# EAGLE design arpie_main (EAGLE 6.6.0)
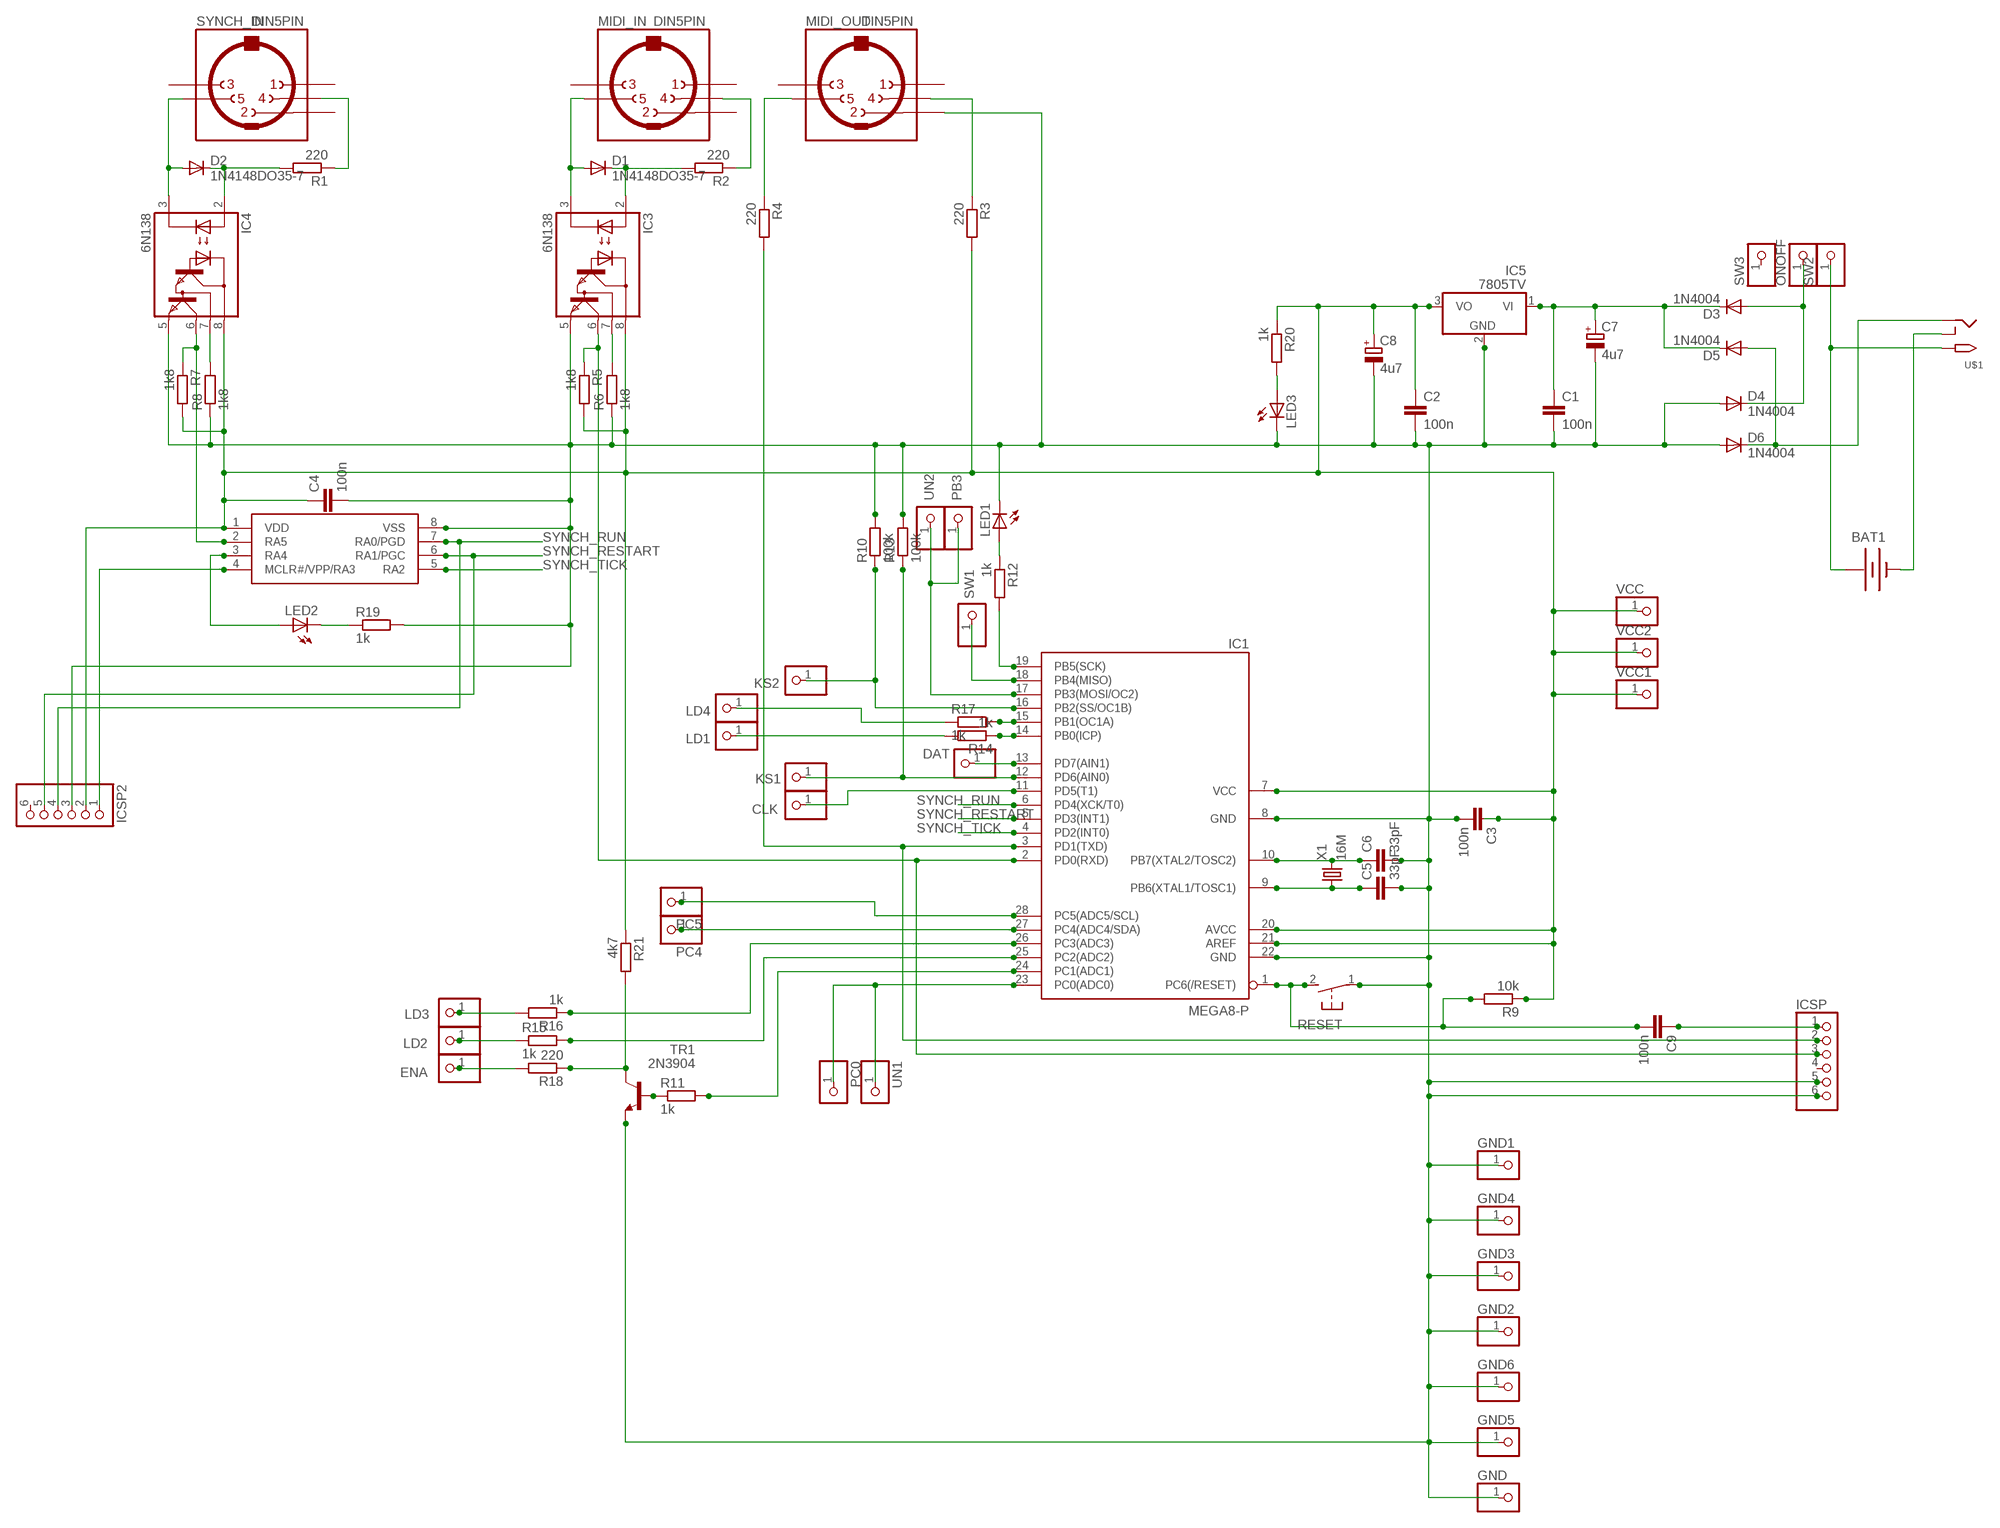
[diagram p0: schematic, sheet 1]

## Parts
BAT1  BATTERY  [PP3_BATTERBOX]
C1  100n  C-EU025-024X044  [C025-024X044]
C2  100n  C-EU025-024X044  [C025-024X044]
C3  100n  C-EU025-024X044  [C025-024X044]
C4  100n  C-EU025-024X044  [C025-024X044]
C5  33pF  C-EU025-024X044  [C025-024X044]
C6  33pF  C-EU025-024X044  [C025-024X044]
C7  4u7  CPOL-EUE2.5-7  [E2,5-7]
C8  4u7  CPOL-EUE2.5-7  [E2,5-7]
C9  100n  C-EU025-024X044  [C025-024X044]
CLK  PINHD-1X1  [1X01]
D1  1N4148DO35-7  [DO35-7]
D2  1N4148DO35-7  [DO35-7]
D3  1N4004  [DO-VERT]
D4  1N4004  [DO-VERT]
D5  1N4004  [DO-VERT]
D6  1N4004  [DO-VERT]
DAT  PINHD-1X1  [1X01]
ENA  PINHD-1X1  [1X01]
GND  PINHD-1X1  [1X01]
GND1  PINHD-1X1  [1X01]
GND2  PINHD-1X1  [1X01]
GND3  PINHD-1X1  [1X01]
GND4  PINHD-1X1  [1X01]
GND5  PINHD-1X1  [1X01]
GND6  PINHD-1X1  [1X01]
IC1  MEGA8-P  [DIL28-3]
IC2  PIC12F1822  [DIL08]
IC3  6N138  [DIL08]
IC4  6N138  [DIL08]
IC5  7805TV  [TO220V]
ICSP  PINHD-1X6  [1X06]
ICSP2  PINHD-1X6  [1X06]
KS1  PINHD-1X1  [1X01]
KS2  PINHD-1X1  [1X01]
LD1  PINHD-1X1  [1X01]
LD2  PINHD-1X1  [1X01]
LD3  PINHD-1X1  [1X01]
LD4  PINHD-1X1  [1X01]
LED1  LED3MM  [LED3MM]
LED2  LED3MM  [LED3MM]
LED3  LED3MM  [LED3MM]
MIDI_IN  DIN5PIN  DIN5PINRAPIDDIN5  [RAPIDDIN5]
MIDI_OUT  DIN5PIN  DIN5PINRAPIDDIN5  [RAPIDDIN5]
ONOFF  PINHD-1X1  [1X01]
PB3  PINHD-1X1  [1X01]
PC0  PINHD-1X1  [1X01]
PC4  PINHD-1X1  [1X01]
PC5  PINHD-1X1  [1X01]
R1  220  R-EU_0207/7  [0207/7]
R2  220  R-EU_0207/7  [0207/7]
R3  220  R-EU_0207/7  [0207/7]
R4  220  R-EU_0207/7  [0207/7]
R5  1k8  R-EU_0207/7  [0207/7]
R6  1k8  R-EU_0207/7  [0207/7]
R7  1k8  R-EU_0207/7  [0207/7]
R8  1k8  R-EU_0207/7  [0207/7]
R9  10k  R-EU_0207/7  [0207/7]
R10  100k  R-EU_0207/7  [0207/7]
R11  1k  R-EU_0207/7  [0207/7]
R12  1k  R-EU_0207/7  [0207/7]
R13  100k  R-EU_0207/2V  [0207/2V]
R14  1k  R-EU_0207/2V  [0207/2V]
R15  1k  R-EU_0207/2V  [0207/2V]
R16  1k  R-EU_0207/2V  [0207/2V]
R17  1k  R-EU_0207/2V  [0207/2V]
R18  220  R-EU_0207/2V  [0207/2V]
R19  1k  R-EU_0207/7  [0207/7]
R20  1k  R-EU_0207/7  [0207/7]
R21  4k7  R-EU_0207/2V  [0207/2V]
RESET  31-XX  [B3F-31XX]
SW1  PINHD-1X1  [1X01]
SW2  PINHD-1X1  [1X01]
SW3  PINHD-1X1  [1X01]
SYNCH_IN  DIN5PIN  DIN5PINRAPIDDIN5  [RAPIDDIN5]
TR1  2N3904  [TO92]
U$1  2.1MMJACKTHM  [PJ-102A]
UN1  PINHD-1X1  [1X01]
UN2  PINHD-1X1  [1X01]
VCC  PINHD-1X1  [1X01]
VCC1  PINHD-1X1  [1X01]
VCC2  PINHD-1X1  [1X01]
X1  16M  CRYSTALHC49S  [HC49/S]

## Nets
CLK: CLK.1 IC1.11(PD5(T1))
DAT: DAT.1 IC1.13(PD7(AIN1))
ENA: ENA.1 R18.2
GND: C1.2 C2.2 C3.2 C4.2 C5.2 C6.2 C7.- C8.- D4.A D6.A GND1.1 GND2.1 GND3.1 GND4.1 GND5.1 GND6.1 GND.1 IC1.8(GND) IC1.22(GND) IC2.8(VSS) IC3.5(GND) IC4.5(GND) IC5.2(GND) ICSP2.3 ICSP.5 ICSP.6 LED1.K(C) LED3.K(C) MIDI_OUT.2 R6.1 R8.1 R10.2 R13.2 R19.2 RESET.1(P) TR1.3(E)
KS1: IC1.12(PD6(AIN0)) KS1.1 R13.1
KS2: IC1.16(PB2(SS/OC1B)) KS2.1 R10.1
LD1: LD1.1 R14.2
LD2: LD2.1 R15.1
LD3: LD3.1 R16.2
LD4: LD4.1 R17.1
N$1: D1.A IC3.3(C) MIDI_IN.5
N$2: D1.C IC3.2(A) R2.2
N$3: MIDI_IN.4 R2.1
N$4: D2.A IC4.3(C) SYNCH_IN.5
N$5: D2.C IC4.2(A) R1.2
N$6: R1.1 SYNCH_IN.4
N$7: IC1.2(PD0(RXD)) IC3.6(VO) ICSP.3 R5.1
N$8: IC3.7(VB) R6.2
N$9: C9.1 ICSP.1
N$10: IC4.7(VB) R8.2
N$11: MIDI_OUT.5 R4.1
N$12: IC1.3(PD1(TXD)) ICSP.2 R4.2
N$13: MIDI_OUT.4 R3.1
N$14: R18.1 R21.2 TR1.1(C)
N$15: IC2.2(RA5) IC4.6(VO) R7.1
N$16: IC2.3(RA4) LED2.A
N$17: IC1.28(PC5(ADC5/SCL)) PC5.1
N$18: IC2.4(MCLR#/VPP/RA3) ICSP2.1
N$19: LED3.A R20.2
N$20: IC1.27(PC4(ADC4/SDA)) PC4.1
N$22: D5.A D6.C U$1.RING
N$33: R11.1 TR1.2(B)
N$35: IC1.26(PC3(ADC3)) R16.1
N$36: C6.1 IC1.10(PB7(XTAL2/TOSC2)) X1.2
N$37: C5.1 IC1.9(PB6(XTAL1/TOSC1)) X1.1
N$38: C9.2 IC1.1(PC6(/RESET)) R9.2 RESET.2(S)
N$42: IC1.25(PC2(ADC2)) R15.2
N$43: IC1.24(PC1(ADC1)) R11.2
N$44: IC1.14(PB0(ICP)) R14.1
N$48: IC1.19(PB5(SCK)) R12.2
N$50: LED1.A R12.1
N$52: LED2.K(C) R19.1
N$54: D3.A D4.C ONOFF.1
N$55: IC1.15(PB1(OC1A)) R17.2
N$56: BAT1.0V(-) U$1.RING_SW
PWR+: BAT1.9V(+) SW2.1 U$1.TIP
SW1: IC1.18(PB4(MISO)) SW1.1
SYNCH_RESTART: IC1.5(PD3(INT1)) IC2.6(RA1/PGC) ICSP2.5
SYNCH_RUN: IC1.6(PD4(XCK/T0)) IC2.7(RA0/PGD) ICSP2.4
SYNCH_TICK: IC1.4(PD2(INT0)) IC2.5(RA2)
UN1: IC1.23(PC0(ADC0)) PC0.1 UN1.1
UN2: IC1.17(PB3(MOSI/OC2)) PB3.1 UN2.1
VCC: C2.1 C3.1 C4.1 C8.+ IC1.7(VCC) IC1.20(AVCC) IC1.21(AREF) IC2.1(VDD) IC3.8(VCC) IC4.8(VCC) IC5.3(VO) ICSP2.2 R3.2 R5.2 R7.2 R9.1 R20.1 R21.1 VCC1.1 VCC2.1 VCC.1
VIN: C1.1 C7.+ D3.C D5.C IC5.1(VI)
Unconnected: ICSP2.6 ICSP.4 MIDI_IN.1 MIDI_IN.2 MIDI_IN.3 MIDI_OUT.1 MIDI_OUT.3 SW3.1 SYNCH_IN.1 SYNCH_IN.2 SYNCH_IN.3

## Library data of the parts
BAT1 = jasons_stuff:BATTERY: Battery Holders Various common sizes : AA, AAA, 20mm coin cell and 12mm coin cell.
C1-C6 C9 = rcl:C-EU: CAPACITOR, European symbol
C7 C8 = rcl:CPOL-EU: POLARIZED CAPACITOR, European symbol
CLK DAT ENA GND GND1-GND6 KS1 KS2 LD1-LD4 ONOFF PB3 PC0 PC4 PC5 SW1-SW3 UN1 UN2 VCC VCC1 VCC2 = adafruit:PINHD-1X1: Pin header 1x1 for 0.1" spacing With round pins
D1 D2 = diode:1N4148: DIODE high speed (Philips)
D3-D6 = jasons_stuff:1N4004: DIODE general purpose rectifier, 1 A
IC1 = atmel:MEGA8-P: MICROCONTROLLER 8 Kbytes FLASH, 1 kbytes SRAM, 512 bytes EEPROM, USART, 4-channel 10 bit ADC, 2-channel 8 bit ADC Pin compatible with Atmega48, ATMega88, ATMega168 Source: avr.lbr
IC2 = jasons_stuff:PIC12F1822
IC3 IC4 = optocoupler:6N138: MOTOROLA OPTO COUPLER
IC5 = linear:78*: Positive VOLTAGE REGULATOR Source: http://cache.national.com/ds/LM/LM78L05.pdf http://www.fairchildsemi.com/ds/LM/LM7805.pdf
ICSP ICSP2 = adafruit:PINHD-1X6: PIN HEADER
LED1-LED3 = adafruit:LED: LED OSRAM: - CHIPLED LG R971, LG N971, LY N971, LG Q971, LY Q971, LO R971, LY R971 LH N974, LH R974 LS Q976, LO Q976, LY Q976 LO Q996 - Hyper CHIPLED LW Q18S LB Q993, LB Q99A, LB R99A - SideLED LS A670, LO A670, LY A670, LG A670, LP A670 LB A673, LV A673, LT A673, LW A673 LH A674 LY A675 LS A676, LA A676, LO A676, LY A676, LW A676 LS A679, LY A679, LG A679 - Hyper Micro SIDELED® LS Y876, LA Y876, LO Y876, LY Y876 LT Y87S - SmartLED LW L88C, LW L88S LB L89C, LB L89S, LG L890 LS L89K, LO L89K, LY L89K LS L896, LA L896, LO L896, LY L896 - TOPLED LS T670, LO T670, LY T670, LG T670, LP T670 LSG T670, LSP T670, LSY T670, LOP T670, LYG T670 LG T671, LOG T671, LSG T671 LB T673, LV T673, LT T673, LW T673 LH T674 LS T676, LA T676, LO T676, LY T676, LB T676, LH T676, LSB T676, LW T676 LB T67C, LV T67C, LT T67C, LS T67K, LO T67K, LY T67K, LW E67C LS E67B, LA E67B, LO E67B, LY E67B, LB E67C, LV E67C, LT E67C LW T67C LS T679, LY T679, LG T679 LS T770, LO T770, LY T770, LG T770, LP T770 LB T773, LV T773, LT T773, LW T773 LH T774 LS E675, LA E675, LY E675, LS T675 LS T776, LA T776, LO T776, LY T776, LB T776 LHGB T686 LT T68C, LB T68C - Hyper Mini TOPLED® LB M676 - Mini TOPLED Santana® LG M470 LS M47K, LO M47K, LY M47K Source: http://www.osram.convergy.de/
MIDI_IN MIDI_OUT SYNCH_IN = jasons_stuff:DIN5PIN: Female CONNECTOR 5 pins 90 deg. with shield, horizontal (DIN 41524)
R1-R21 = rcl:R-EU_: RESISTOR, European symbol
RESET = switch-omron:31-XX: OMRON SWITCH
TR1 = transistor:2N3904: NPN TRANSISTOR
U$1 = adafruit:2.1MMJACK: 2.1mm x 5.5mm THM DC jack with internal switch. Digikey part #PJ-102A, 4UCON part #05537 2.1mm x 5.5mm SMT DC jack with internal switch. Digikey part #PJ-002A-SMT, 4UCON part #03267 By microbuilder.eu & adafruit.com
X1 = crystal:CRYSTAL: CRYSTAL

## Board
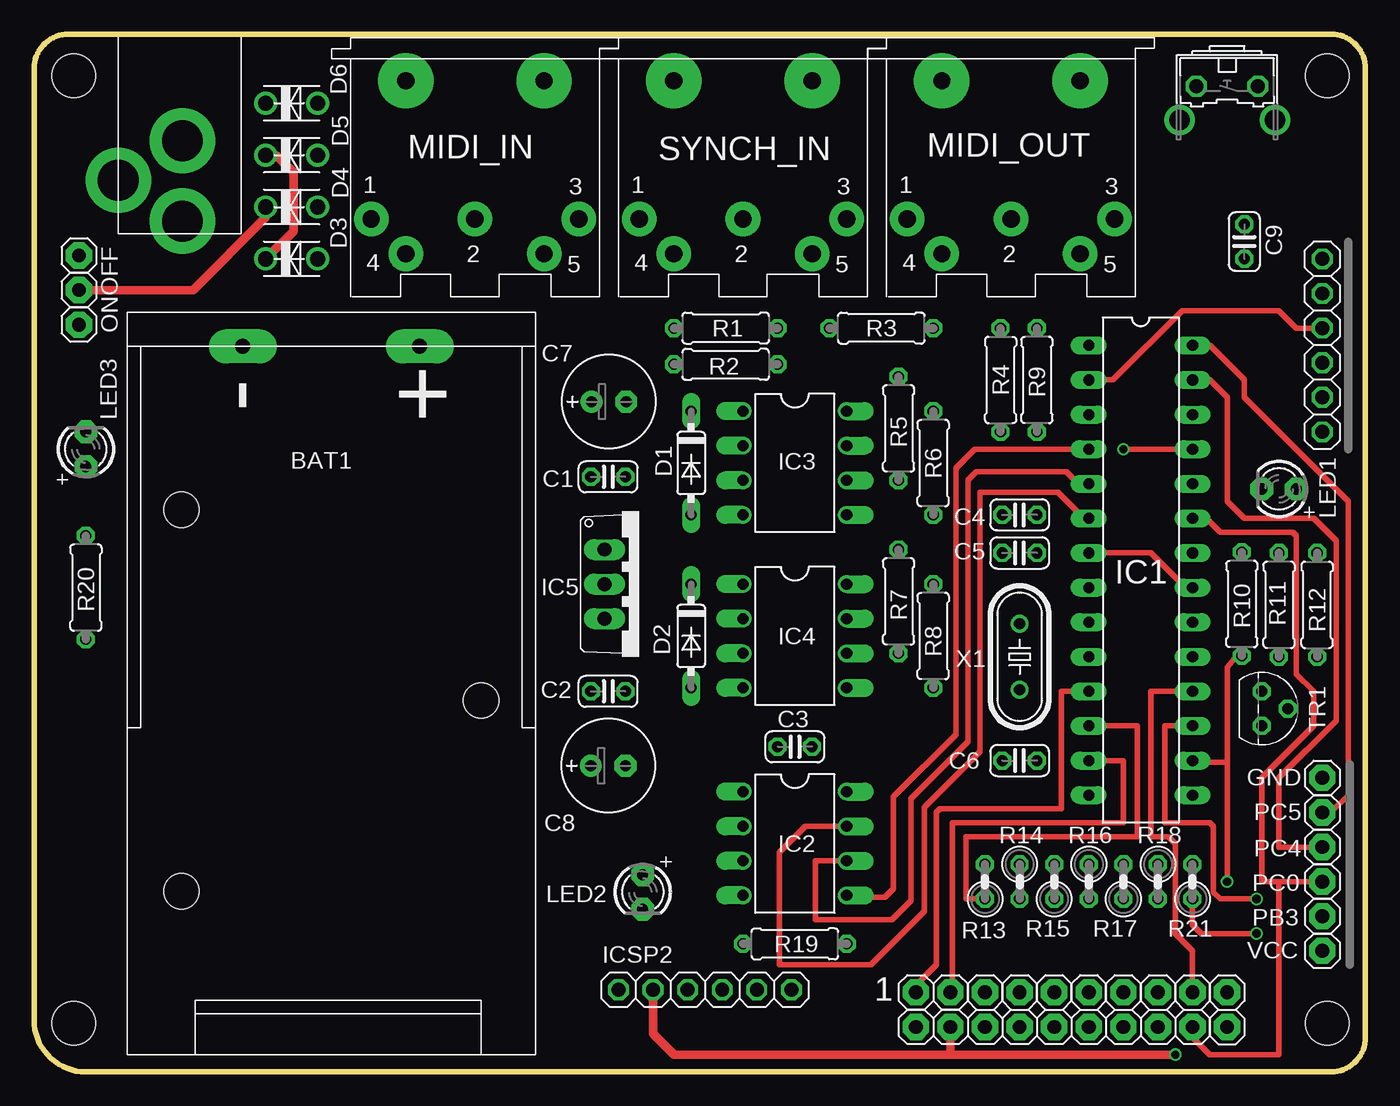
[diagram p1: board, top side]
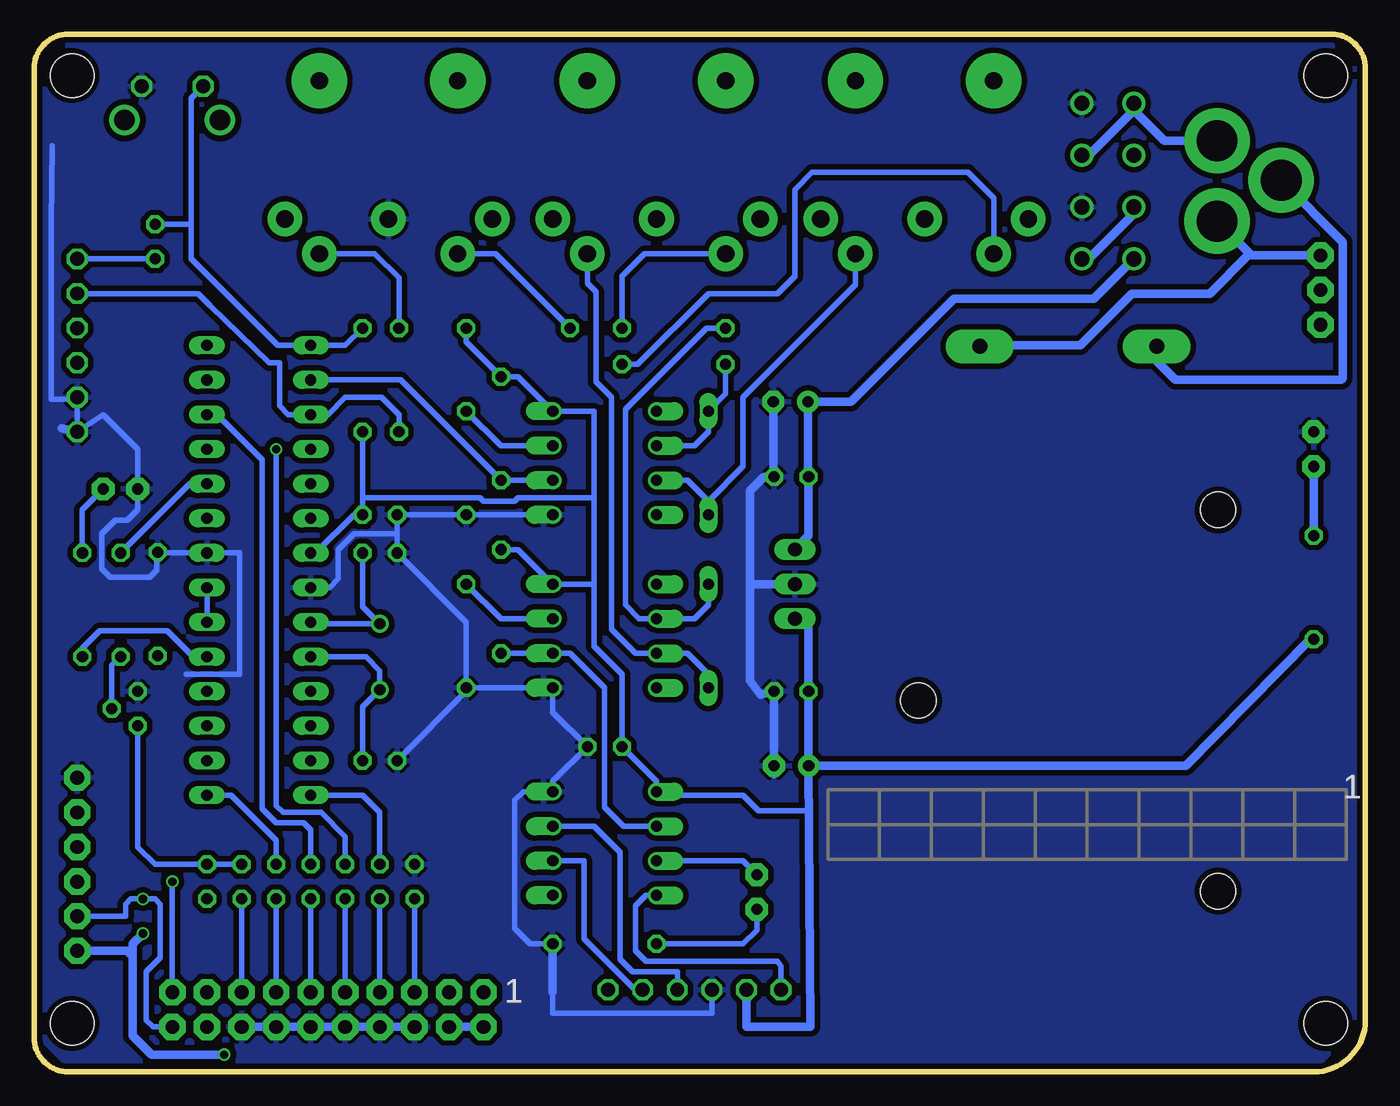
[diagram p2: board, bottom side, seen from below]

Size 97.79 x 76.2 mm. Coordinates in mm from the lower left corner, seen from the top.
Outline: 0,73.66 arc-90 2.54,76.2 95.25,76.2 arc-90 97.79,73.66 97.79,2.54 arc-90 95.25,0 3.81,0 arc-90 0,3.81 0,73.66
Copper layers (1*16): Top 0.035mm / dielectric 1.5mm / Bottom 0.035mm
Design rules "ITEADstudio_DRC": minimum track width 6mil, minimum drill 12mil, track to track 6mil, track to pad 6mil, pad to pad 6mil, via to via 6mil, smd to smd 0mil, copper to edge 10mil, drill to drill 10mil, minimum pad ring 10mil, minimum via ring 6mil, stop-mask expansion 2mil, vias tented up to drill 100mil, thermal gap 10mil
Holes 3.2 mm at 2.92,73.15 2.92,3.56 95,73.15 95,3.56

### Footprints (pad centres in the part's own frame; a part is rotated, then mirrored left to right if it is on the bottom)
PP3_BATTERBOX = drill 1.1 pad 2.5 long: 0V 52,21.5; 9V 52,8.5 | hole 2.6: 12,26; 40,26; 26,4
C025-024X044 = drill 0.813 octagon: 1 -1.27,0; 2 1.27,0
E2,5-7 = drill 0.813 pad 1.6: + -1.27,0 | drill 0.813 pad 1.6 octagon: - 1.27,0
1X01 = drill 1.016 pad 1.93 octagon: 1 0,0
DO35-7 = drill 0.813 long: A 3.81,0; C -3.81,0
DO-VERT = drill 1.118: A 2.54,0; C -1.27,0
DIL28-3 = drill 0.813 long: 1 -16.51,-3.81; 2 -13.97,-3.81; 3 -11.43,-3.81; 4 -8.89,-3.81; 5 -6.35,-3.81; 6 -3.81,-3.81; 7 -1.27,-3.81; 8 1.27,-3.81; 9 3.81,-3.81; 10 6.35,-3.81; 11 8.89,-3.81; 12 11.43,-3.81; 13 13.97,-3.81; 14 16.51,-3.81; 15 16.51,3.81; 16 13.97,3.81; 17 11.43,3.81; 18 8.89,3.81; 19 6.35,3.81; 20 3.81,3.81; 21 1.27,3.81; 22 -1.27,3.81; 23 -3.81,3.81; 24 -6.35,3.81; 25 -8.89,3.81; 26 -11.43,3.81; 27 -13.97,3.81; 28 -16.51,3.81
DIL08 = drill 0.813 offset: 1 -3.81,-3.81; 2 -1.27,-3.81; 3 1.27,-3.81; 4 3.81,-3.81; 5 3.81,3.81; 6 1.27,3.81; 7 -1.27,3.81; 8 -3.81,3.81
TO220V = drill 1.016 long: 1 -2.54,-2.54; 2 0,-2.54; 3 2.54,-2.54
1X06 = drill 1.016 octagon: 1 -6.35,0; 2 -3.81,0; 3 -1.27,0; 4 1.27,0; 5 3.81,0; 6 6.35,0
LED3MM = drill 0.813 pad 1.676 octagon: A -1.27,0; K 1.27,0
RAPIDDIN5 = drill 1.27 pad 2.54: 1 7.62,5.08; 2 0,5.08; 3 -7.62,5.08; 4 5.08,7.62; 5 -5.08,7.62 | drill 1.27 pad 4.064: NC -5.08,-5.08; NC@ 5.08,-5.08
0207/7 = drill 0.813 octagon: 1 -3.81,0; 2 3.81,0
0207/2V = drill 0.813 octagon: 1 -1.27,0; 2 1.27,0
B3F-31XX = drill 1.016 octagon: 1 -2.261,-1.245; 2 2.261,-1.245 | drill 1.499 pad 2.159: 3 -3.505,1.245; 4 3.505,1.245
TO92 = drill 0.813 octagon: 1 1.27,0; 2 0,1.905; 3 -1.27,0
PJ-102A = drill 3 pad 4.8: RING 0.1,-3.39; RING_SW -4.6,-6.29; TIP 0.1,-9.29
HC49/S = drill 0.813: 1 -2.413,0; 2 2.413,0

### Placement (x,y rotation side)
BAT1  36.83,1.27 90 top
C1  42.16,43.69 0 top
C2  42.16,27.94 0 top
C3  55.88,23.88 0 top
C4  72.39,40.89 180 top
C5  72.39,38.1 180 top
C6  72.39,22.86 180 top
C7  42.23,49.21 0 top
C8  42.16,22.48 0 top
C9  88.9,60.96 90 top
CLK  64.77,5.84 0 top
D1  48.26,44.7 270 top
D2  48.26,32 270 top
D3  18.29,59.69 0 top
D4  18.29,63.5 0 top
D5  18.29,67.31 0 top
D6  18.29,71.12 0 top
DAT  67.31,5.84 0 top
ENA  82.55,5.84 90 top
GND  94.61,21.59 0 top
GND1  69.85,3.3 0 top
GND2  72.39,3.3 0 top
GND3  74.93,3.3 0 top
GND4  77.47,3.3 0 top
GND5  80.01,3.3 0 top
GND6  82.55,3.3 0 top
IC1  81.28,36.83 270 top
IC2  55.88,16.76 270 top
IC3  55.88,44.7 270 top
IC4  55.88,32 270 top
IC5  44.45,35.81 270 top
ICSP  94.61,53.34 270 top
ICSP2  49.28,6.03 0 top
KS1  69.85,5.84 90 top
KS2  87.63,5.84 90 top
LD1  72.39,5.84 90 top
LD2  74.93,5.84 90 top
LD3  77.47,5.84 90 top
LD4  80.01,5.84 90 top
LED1  91.44,42.8 180 top
LED2  44.7,13.21 270 top
LED3  3.81,45.72 90 top
MIDI_IN  32.38,67.69 180 top
MIDI_OUT  71.75,67.69 180 top
ONOFF  3.3,57.4 0 top
PB3  94.61,11.43 0 top
PC0  94.61,13.97 0 top
PC4  94.61,16.51 0 top
PC5  94.61,19.05 0 top
R1  50.8,54.61 180 top
R2  50.8,51.94 180 top
R3  62.23,54.61 0 top
R4  70.99,50.8 270 top
R5  63.5,47.24 90 top
R6  66.04,44.7 90 top
R7  63.5,34.54 90 top
R8  66.04,32 90 top
R9  73.66,50.8 90 top
R10  88.71,34.35 90 top
R11  91.44,34.29 90 top
R12  94.23,34.29 270 top
R13  69.85,13.97 90 top
R14  72.39,13.97 270 top
R15  74.93,13.97 90 top
R16  77.47,13.97 270 top
R17  80.01,13.97 90 top
R18  82.55,13.97 270 top
R19  55.88,9.4 0 top
R20  3.81,35.56 90 top
R21  85.09,13.97 90 top
RESET  87.63,71.12 180 top
SW1  85.09,5.84 90 top
SW2  3.3,59.94 0 top
SW3  3.3,54.86 0 top
SYNCH_IN  52.07,67.69 180 top
TR1  90.17,26.67 270 top
U$1  10.79,71.76 0 top
UN1  85.09,3.3 0 top
UN2  87.63,3.3 90 top
VCC  94.61,8.89 0 top
VCC1  64.77,3.3 0 top
VCC2  67.31,3.3 0 top
X1  72.39,30.48 270 top

### Tracks (layer width: path | path; a pad name or v marks a point on that pad's centre or on a via)
CLK
  Top 0.406: IC1.11 75.44,27.94 75.44,19.3 66.55,19.3 66.29,19.05 66.29,7.87 64.77,6.35 CLK.1
DAT
  Top 0.406: DAT.1 67.44,5.97 67.44,18.29 80.01,18.29 80.01,22.86 IC1.13
ENA
  Bottom 0.406: ENA.1 R18.2
GND
  Bottom 0.406: IC3.5 R6.1 C4.2 71.12,39.37 | R8.1 IC4.5 59.69,26.42 C3.2 59.69,21.34 IC2.8 61.85,20.57 62.48,19.94 62.48,10.54 61.34,9.4 R19.2 | 71.12,39.37 C5.2 66.04,33.02 R8.1 | R8.1 66.04,27.94 C6.2 | IC1.8 76.07,35.56 75.44,36.2 75.44,38.35 74.3,39.5 71.25,39.5 71.12,39.37 | 96.47,68 96.52,62.36 96.52,49.4 94.74,49.4 ICSP.5 ICSP.6 92.71,48.26 90.17,45.72 LED1.K 90.17,41.27 90.93,40.51 91.82,40.51 92.84,39.5 92.84,36.96 92.2,36.32 89.28,36.32 88.77,36.83 88.77,38.1 R10.2 88.65,38.1 IC1.22 82.68,38.1 82.68,29.21 86.61,29.21 | 59.69,5.84 59.69,4.32 48.01,4.32 ICSP2.3 | 45.21,28.7 45.21,38.48
  Bottom 0.61: C7.- 43.5,43.75 C1.2 44.2,43.69 45.21,42.67 45.21,38.48 45.21,35.56 | 45.21,35.56 45.21,28.7 44.45,27.69 C2.2 C8.- 43.43,21.84 | IC5.2 44.96,35.81 45.21,35.56 | GND2.1 GND3.1 GND4.1 GND5.1 | ICSP.6 95.76,47.24 | GND1.1 GND2.1 | GND2.1 GND6.1 | 59.69,5.84 R19.2
  pour Bottom (isolate 0.406): 0.51,3.56 0.51,73.15 0.51,73.41 2.79,75.69 95,75.69 97.41,73.28 97.41,3.56 97.41,2.67 95.12,0.38 3.68,0.38
KS1
  Top 0.406: IC1.12 81.03,25.4 81.03,17.27 68.45,17.27 68.45,12.7 R13.1
  Bottom 0.406: KS1.1 R13.1
KS2  (via drill 0.6)
  Top 0.406: R10.1 88.33,30.54 87.63,29.72 87.63,22.73 | 87.63,22.73 85.22,22.73 IC1.16 | 87.63,13.86 v87.63,13.97 87.63,22.73
  Bottom 0.406: KS2.1 v87.63,13.97
LD1
  Bottom 0.406: LD1.1 R14.2
LD2
  Bottom 0.406: LD2.1 R15.1
LD3
  Bottom 0.406: LD3.1 R16.2
LD4
  Bottom 0.406: LD4.1 R17.1
N$1
  Bottom 0.406: IC3.3 49.78,43.43 48.26,41.91 | D1.A 48.26,41.91 | MIDI_IN.5 37.47,57.78 45.72,49.53 45.72,44.45 48.26,41.91
N$2
  Bottom 0.406: IC3.2 49.28,45.97 48.26,46.99 D1.C 46.99,49.78 R2.2
N$3
  Bottom 0.406: MIDI_IN.4 27.3,64.14 29.21,66.04 40.64,66.04 41.91,64.77 41.91,58.42 43.18,57.15 48.26,57.15 53.47,51.94 R2.1
N$4
  Bottom 0.406: D2.A 48.26,29.21 49.78,30.73 IC4.3 53.59,30.73 55.37,32.51 55.37,49.53 56.52,50.67 56.52,57.28 57.15,57.91 SYNCH_IN.5
N$5
  Bottom 0.406: R1.2 48.39,54.61 54.36,48.64 54.36,34.29 53.34,33.27 IC4.2 49.28,33.27 48.26,34.29 D2.C 48.26,36.83
N$6
  Bottom 0.406: R1.1 54.61,58.42 52.96,60.07 SYNCH_IN.4
N$7
  Top 0.406: IC1.2 79.25,50.8 84.33,55.88 91.44,55.88 92.71,54.61 ICSP.3
  Bottom 0.406: IC3.6 R5.1 70.87,50.8 IC1.2
N$8
  Bottom 0.406: IC3.7 63.5,45.97 R6.2
N$9
  Bottom 0.406: C9.1 ICSP.1
N$10
  Bottom 0.406: IC4.7 63.5,33.27 R8.2
N$11
  Bottom 0.406: MIDI_OUT.5 72.77,60.07 70.99,58.29 R4.1
N$12
  Bottom 0.406: ICSP.2 85.72,57.15 84.84,56.26 80.52,52.07 79.76,52.07 79.76,48.89 79.12,48.26 IC1.3 76.2,48.26 74.93,49.53 72.26,49.53 70.99,48.26 R4.2
N$13
  Bottom 0.406: MIDI_OUT.4 63.88,60.07 R3.1
N$14
  Bottom 0.406: TR1.1 90.17,16.51 88.9,15.24 R21.2 R18.1
N$15
  Bottom 0.406: R7.1 IC4.6 58.42,30.73 55.88,28.19 55.88,19.43 54.48,18.03 IC2.2
N$16
  Bottom 0.406: IC2.3 45.72,15.49 LED2.A
N$17
  Top 0.406: IC1.28 86.36,53.34 88.9,50.8 88.9,49.53 96.52,41.91 96.52,20.32 95.25,19.05 PC5.1
N$18
  Bottom 0.406: IC2.4 52.83,12.95 53.59,12.19 53.59,8.89 52.83,8.13 43.18,8.13 42.93,7.75 ICSP2.1 42.93,6.35
N$19
  Bottom 0.61: R20.2 LED3.A
N$20
  Top 0.406: IC1.27 86.36,50.8 87.63,49.53 87.63,41.91 88.9,40.64 93.98,40.64 95.63,38.99 95.63,25.78 91.44,21.59 91.44,16.51 PC4.1 93.98,16.51
N$22
  Bottom 0.61: 17.02,70.61 D6.C | 17.02,70.61 20.32,67.31 D5.A | U$1.RING 14.77,68.37 17.02,70.61
N$33
  Bottom 0.406: TR1.2 92.08,29.84 R11.1
N$35
  Bottom 0.406: IC1.26 84.33,48.26 81.03,44.96 81.03,19.3 80.01,18.29 77.98,18.29 77.47,17.78 R16.1
N$36
  Bottom 0.406: C6.1 73.66,26.8 X1.2 72.39,29.46 73.41,30.48 IC1.10
N$37
  Bottom 0.406: C5.1 73.66,34.16 X1.1 77.34,32.89 IC1.9
N$38
  Bottom 0.406: R9.2 74.93,53.34 IC1.1 79.88,53.34 86.26,59.71 86.26,62.23 | 86.26,62.23 86.26,71.48 RESET.2 | 86.26,62.23 C9.2
N$42  (via drill 0.6)
  Top 0.406: v80.01,45.72 IC1.25
  Bottom 0.406: R15.2 74.93,17.27 76.71,19.05 79.5,19.05 80.01,19.56 v80.01,45.72
N$43
  Bottom 0.406: IC1.24 86.36,43.18 R11.2
N$44
  Bottom 0.406: IC1.14 73.66,20.32 72.39,19.05 R14.1
N$48
  Bottom 0.406: IC1.19 86.11,30.48 88.01,32.38 92.96,32.38 94.23,31.11 R12.2
N$50
  Bottom 0.406: R12.1 94.23,41.27 LED1.A
N$52
  Bottom 0.406: R19.1 45.72,9.4 44.7,10.41 LED2.K
N$54
  Top 0.61: D4.C 17.02,62.74 11.68,57.4 ONOFF.1
  Bottom 0.61: D4.C 17.02,62.99 20.32,59.69 D3.A
N$55
  Bottom 0.406: R17.2 80.01,17.02 83.31,20.32 IC1.15
N$56
  Bottom 0.61: BAT1.0V 15.33,52.16 13.97,50.8 1.78,50.8 1.65,50.93 1.65,60.92 U$1.RING_SW
PWR+
  Bottom 0.61: BAT1.9V 28.26,53.34 20.95,53.34 17.14,57.15 11.43,57.15 8.64,59.94 8.37,59.94 | SW2.1 8.37,59.94 | 8.37,59.94 U$1.TIP
SW1
  Top 0.406: IC1.18 82.04,27.94 82.04,17.27 83.31,17.27 83.82,16.76 83.82,10.16 85.09,8.89 SW1.1
SYNCH_RESTART
  Top 0.406: IC2.6 57.4,15.49 57.4,11.18 62.99,11.18 64.39,12.57 64.39,20.07 68.58,24.26 68.58,43.43 69.21,44.07 75.82,44.07 76.71,43.18 IC1.5
  Bottom 0.406: ICSP2.5 53.66,6.03 57.4,9.78 57.4,15.49 IC2.6
SYNCH_RUN
  Top 0.406: IC1.6 77.09,40.64 75.18,42.55 69.47,42.55 69.47,23.49 65.41,19.43 65.41,11.81 61.47,7.87 54.74,7.87 54.74,16.13 56.64,18.03 IC2.7
  Bottom 0.406: IC2.7 56.64,18.03 54.74,16.13 54.74,8.25 53.85,7.37 50.55,7.37 ICSP2.4
SYNCH_TICK
  Top 0.406: IC2.5 59.82,12.83 62.48,12.83 63.12,13.46 63.12,20.19 67.69,24.77 67.69,44.32 69.09,45.72 IC1.4
UN1
  Top 0.406: UN1.1 85.09,2.54 86.36,1.27 91.44,1.27 91.44,13.97 | IC1.23 86.11,40.64 87.12,39.62 92.46,39.62 92.71,39.37 92.71,29.21 93.98,27.94 93.98,25.4 90.17,21.59 90.17,13.97 91.44,13.97 | 91.44,13.97 PC0.1
UN2  (via drill 0.6)
  Top 0.406: IC1.17 83.06,25.4 83.06,18.29 86.36,18.29 86.61,18.03 86.61,13.21 87.12,12.7 v89.79,12.7
  Bottom 0.406: UN2.1 89.03,3.3 89.53,3.81 89.53,7.37 88.52,8.38 88.52,12.32 88.9,12.7 v89.79,12.7 90.68,12.7 91.06,12.32 91.06,11.43 PB3.1
VCC  (via drill 0.6)
  Top 0.406: IC1.7 82.04,38.1 84.58,35.56 IC1.21 | R21.1 85.09,10.8 85.72,10.16 v89.79,10.16
  Top 0.61: 67.31,1.27 46.99,1.27 45.47,2.79 ICSP2.2 | 67.31,1.27 v83.82,1.27 | 67.31,1.27 VCC2.1
  Bottom 0.406: R7.2 62.23,38.35 IC4.8 56.64,35.81 | IC1.7 77.09,38.1 74.3,40.89 C4.1 73.66,42.29 | 56.64,35.81 56.64,31.24 54.61,29.21 C3.1 52.07,21.34 IC2.1 52.07,20.32 45.72,20.32 44.58,19.18 41.02,19.18 | 56.64,35.81 56.64,42.16 | IC1.21 IC1.20 | 56.64,42.16 62.23,42.16 62.48,41.91 64.77,41.91 65.02,42.16 73.53,42.16 73.66,42.29 | 56.64,42.16 56.64,48.51 IC3.8 62.23,51.05 R5.2 66.04,53.59 R3.2 | 41.02,19.18 40.77,18.92 | C8.+ 40.77,19.43 41.02,19.18 | 73.66,42.29 R9.1
  Bottom 0.61: IC5.3 41.4,33.27 40.89,32.77 C2.1 C8.+ | C8.+ 40.89,21.84 | C8.+ 40.77,3.3 45.47,3.3 ICSP2.2 | R20.1 4.06,31.75 13.21,22.48 C8.+ | VCC2.1 VCC1.1 | v83.82,1.27 89.15,1.27 90.55,2.67 90.55,8.51 | VCC.1 90.93,8.89 90.55,8.51 | 90.55,8.51 90.55,9.4 v89.79,10.16
VIN
  Top 0.61: D5.C 17.78,67.31 19.05,66.04 19.05,61.72 D3.C
  Bottom 0.61: D3.C 19.94,56.77 30.23,56.77 37.78,49.21 C7.+ 40.96,43.75 C1.1 40.89,39.37 IC5.1

### Text on the board
tPlace: 1
bPlace: 1 | 1
tDocu: Reset | 1 | Prog | Serial | 1
bDocu: midi arpeggiator | main board | rev 4 | hotchk155 | CLK | DAT | KS1 | LD1 | LD2 | LD3 | LD4 | STR | SW1 | KS2 | VCC | VCC | GND | GND | GND | GND | GND | GND | UN1 | UN2 | six4pix.com/arpie